# EAGLE design LEDs1 (EAGLE 6.3)
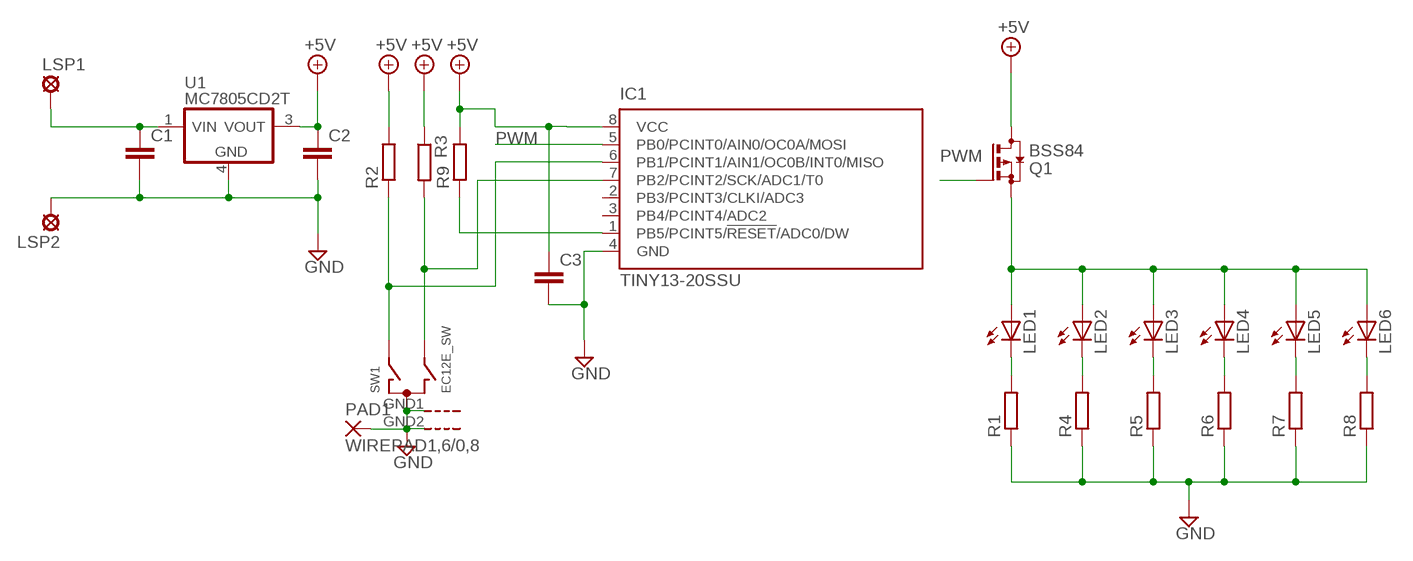
[diagram p0: schematic, sheet 1]

## Parts
C1  C-EUC1206K  [C1206K]
C2  C-EUC1206K  [C1206K]
C3  C-EUC1206K  [C1206K]
IC1  TINY13-20SSU  [8S1]
LED1  LED-2AC-CP41B-WES  [CP41B]
LED2  LED-2AC-CP41B-WES  [CP41B]
LED3  LED-2AC-CP41B-WES  [CP41B]
LED4  LED-2AC-CP41B-WES  [CP41B]
LED5  LED-2AC-CP41B-WES  [CP41B]
LED6  LED-2AC-CP41B-WES  [CP41B]
LSP1  LSP10  [LSP10]
LSP2  LSP10  [LSP10]
PAD1  WIREPAD1,6/0,8  [1,6/0,8]
Q1  BSS84  [SOT23]
R1  R-EU_M0805  [M0805]
R2  R-EU_M1206  [M1206]
R3  R-EU_M1206  [M1206]
R4  R-EU_M0805  [M0805]
R5  R-EU_M0805  [M0805]
R6  R-EU_M0805  [M0805]
R7  R-EU_M0805  [M0805]
R8  R-EU_M0805  [M0805]
R9  R-EU_M0805  [M0805]
SW1  EC12E_SW  [ALPS_EC12E_SW]
U1  MC7805CD2T  [D2PAK-3]

## Nets
+5V: C2.1 C3.1 IC1.8(VCC) Q1.3(D) R2.2 R3.1 R9.2 U1.3(VOUT)
GND: C1.2 C2.2 C3.2 IC1.4(GND) LSP2.MP PAD1.1(P) R1.1 R4.1 R5.1 R6.1 R7.1 R8.1 SW1.C SW1.GND1(G) SW1.GND2(G) U1.4(GND)
N$1: C1.1 LSP1.MP U1.1(VIN)
N$3: IC1.6(PB1/PCINT1/AIN1/OC0B/INT0/MISO) R2.1 SW1.A
N$4: IC1.7(PB2/PCINT2/SCK/ADC1/T0) R3.2 SW1.B
N$5: IC1.1(PB5/PCINT5/!RESET!/ADC0/DW) R9.1
N$7: LED1.2(A) LED1.3(A) LED2.2(A) LED2.3(A) LED3.2(A) LED3.3(A) LED4.2(A) LED4.3(A) LED5.2(A) LED5.3(A) LED6.2(A) LED6.3(A) Q1.2(S)
N$8: LED1.1(C) LED1.4(C) R1.2
N$9: LED2.1(C) LED2.4(C) R4.2
N$10: LED3.1(C) LED3.4(C) R5.2
N$11: LED4.1(C) LED4.4(C) R6.2
N$12: LED5.1(C) LED5.4(C) R7.2
N$13: LED6.1(C) LED6.4(C) R8.2
PWM: IC1.5(PB0/PCINT0/AIN0/OC0A/MOSI) Q1.1(G)
Unconnected: IC1.2(PB3/PCINT3/CLKI/ADC3) IC1.3(PB4/PCINT4/ADC2) SW1.D SW1.E

## Library data of the parts
C1-C3 = rcl:C-EU: CAPACITOR, European symbol
IC1 = atmel:TINY13: 8-bit AVR Microcontroller with 1K Bytes In-System Programmable Flash Source: http://www.atmel.com/dyn/resources/prod_documents/2535S.pdf; MPN: ATTINY13-20SSU; OC_FARNELL: 1455133; OC_NEWARK: 58M3771
LED1-LED6 = led:LED-2AC-: LEDs with 2 Cathode & 2 Anode - Kingbright SUPER FLUX LED LAMP Source: www.us.kingbright.com/images/catalog/SPEC/W7676CPBC-H.pdf Cree® P4 LED CP41B-WES/WGS Source: Data sheet <http://www.cree.com/products/pdf/LEDlamps/CP41B-WES&WGS.pdf>
LSP1 LSP2 = solpad:LSP10: SOLDER PAD drill 1.0 mm, distributor Buerklin, 12H555
PAD1 = wirepad:WIREPAD: Wire PAD connect wire on PCB
Q1 = transistor-small-signal:BSS84: P-CHANNEL MOS FET
R1-R9 = resistor:R-EU_: RESISTOR, European symbol
SW1 = switch-alps:EC12E_SW: ALPS rotary Encoder EC12E series with switch; MPN: EC12E2424407; OC_FARNELL: 1520813; OC_NEWARK: 74M1068
U1 = _hhn_78xx_79xx_NCV78xx_d2pak_dpak:MC78*: 78xx SMD (D2PAK, DPAK) (MC)78xx..DT (DPAK-3; Rth,JA = 92 K/W) (MC)78xx..D2T (D2PAK-3; Rth,JA = 45 K/W @ 10x10mm copper area) Linear Voltage Regulators, Positive, 1 A (ON Semiconductor) Package dimenisions and soldering footprints acc. to ONSEMI specs. Source: http://onsemi.com Datasheet document#: MC7800/D Technologies: 78xxyD(2)Tz: xx = Output Voltage (V) y, z: additional suffixes see manufacturer's datasheet Author: Dipl.-Ing. FH Rainer Bayer HHN Hochschule Heilbronn, rainer.bayer@hs-heilbronn.de Ingenieurbüro ing-rb, mail@ing-rb.de

## Board
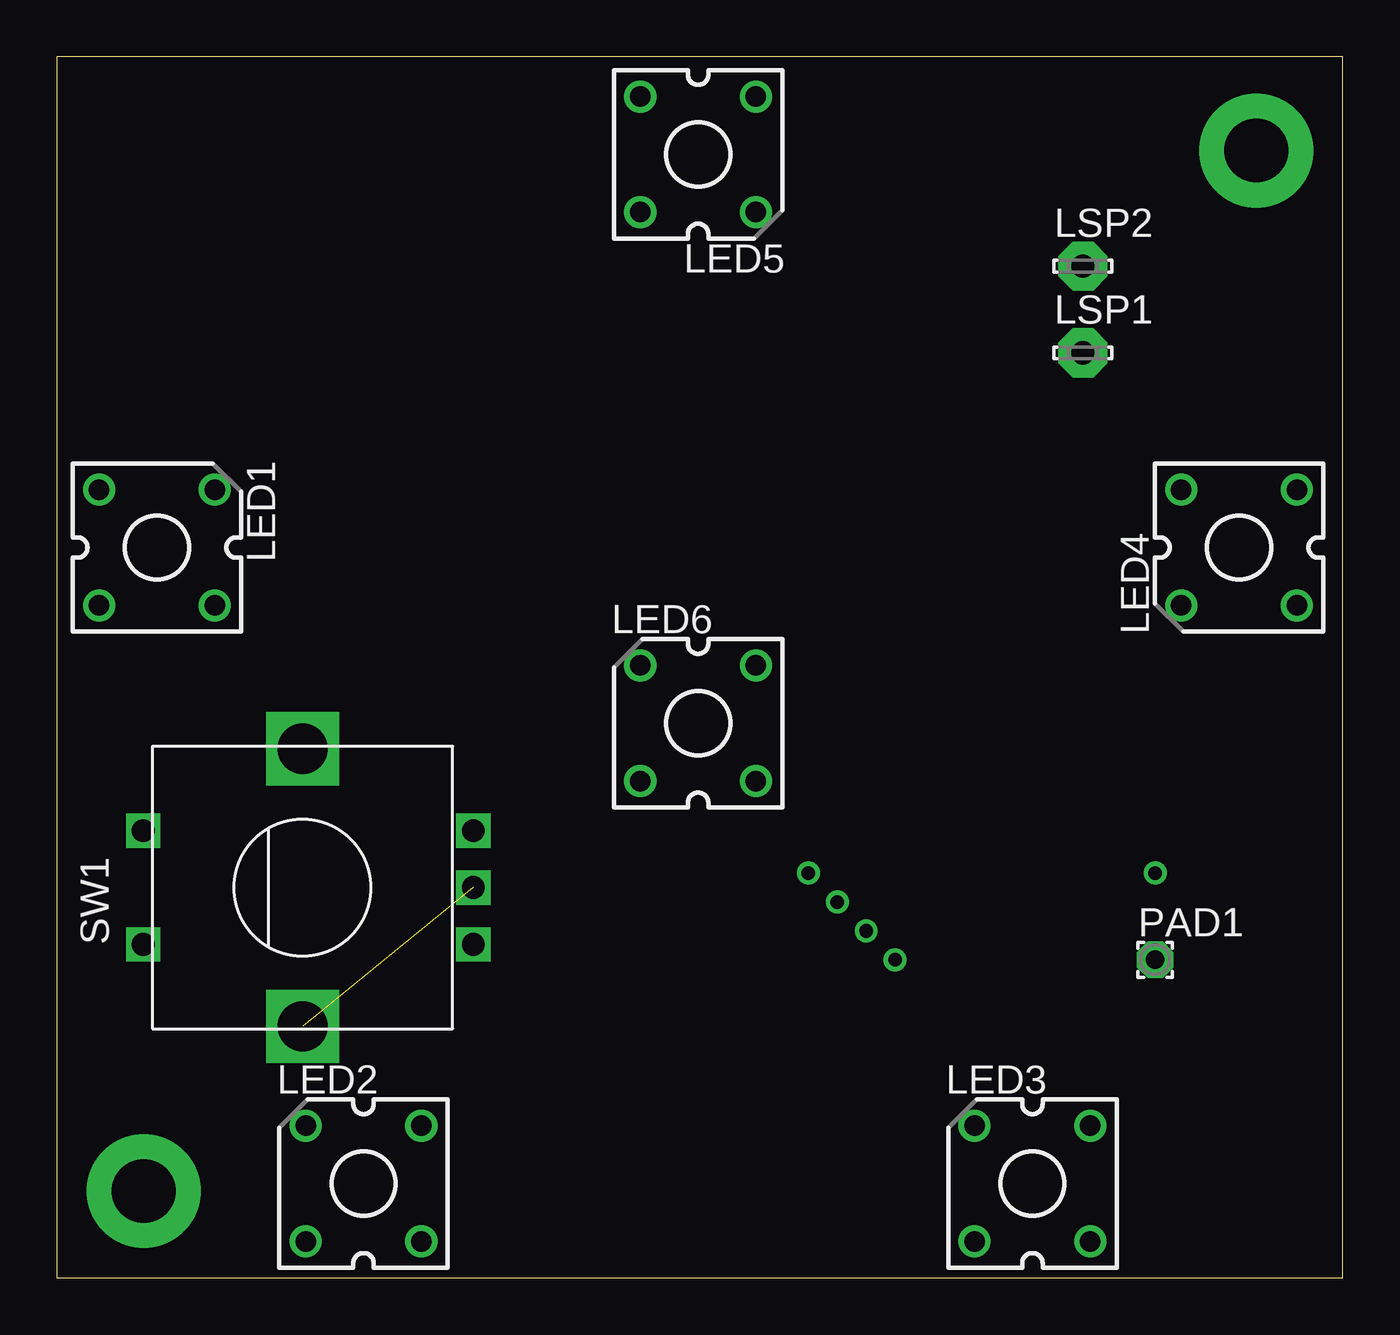
[diagram p1: board, top side]
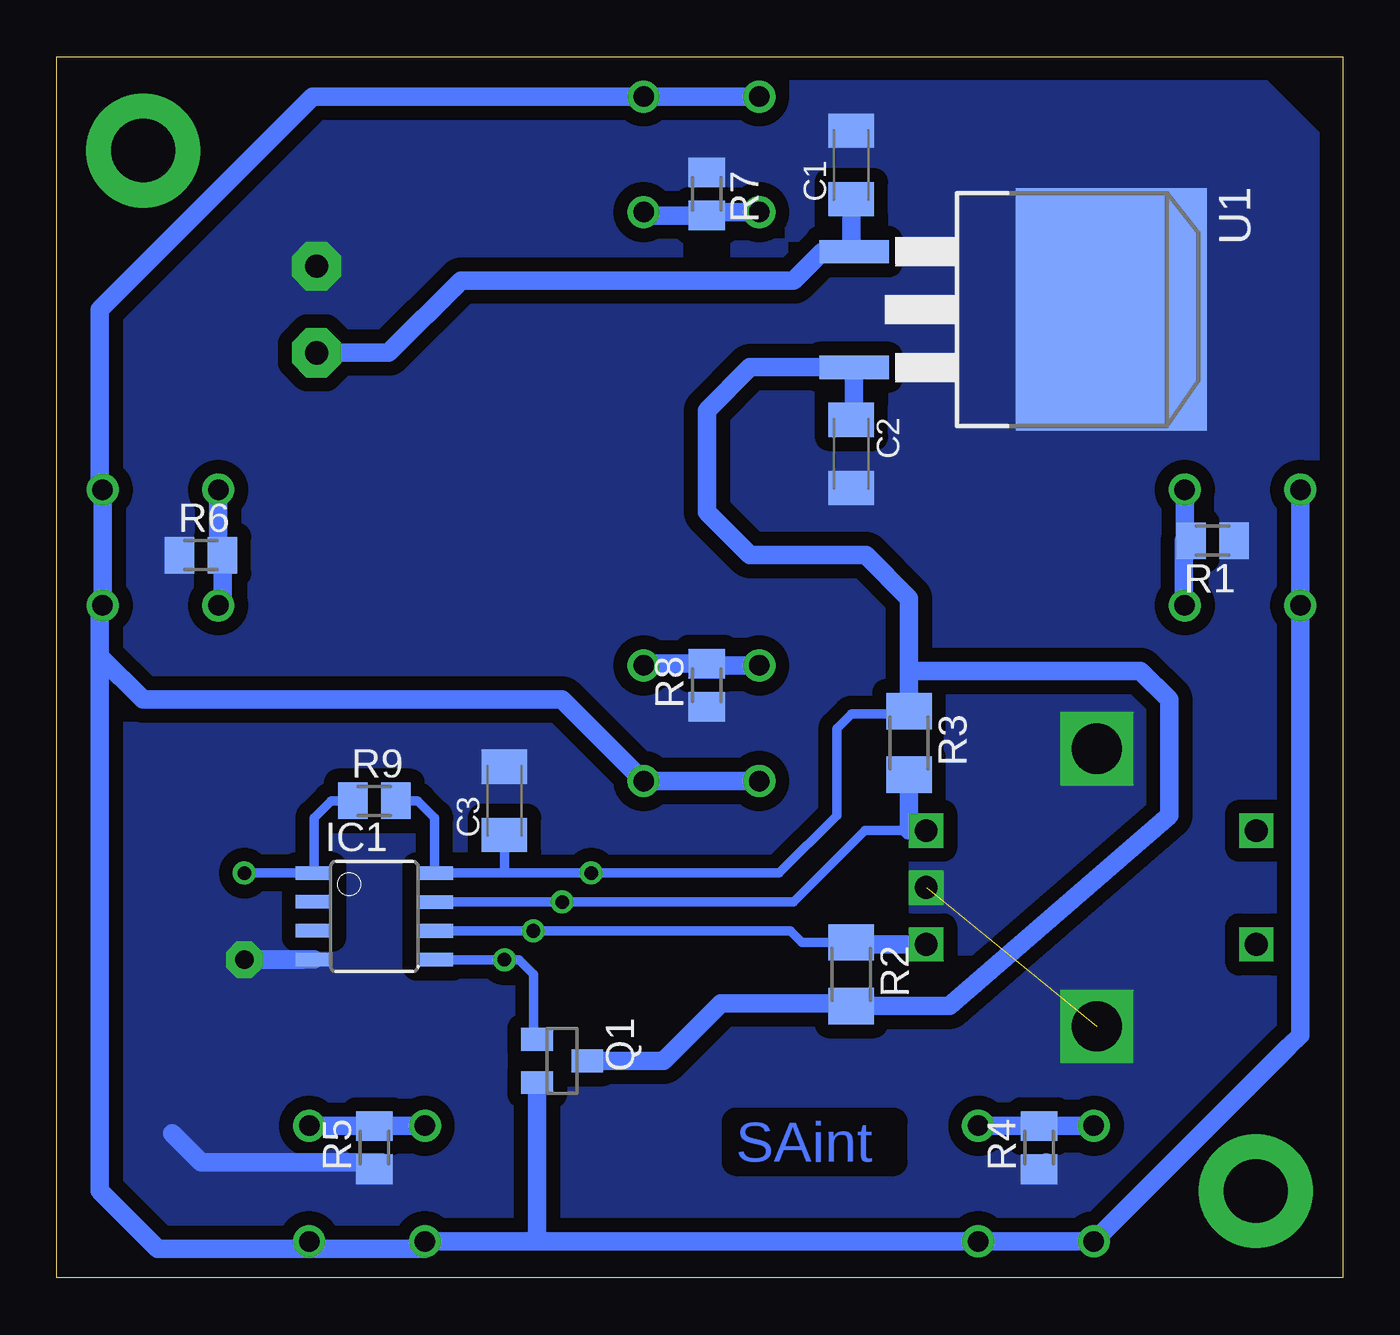
[diagram p2: board, bottom side, seen from below]

Size 56.49 x 53.65 mm. Coordinates in mm from the lower left corner, seen from the top.
Outline: 0,0 56.49,0 56.49,53.65 0,53.65 0,0
Copper layers (1*16): Top 0.035mm / dielectric 1.5mm / Bottom 0.035mm
Design rules "default": minimum track width 10mil, minimum drill 24mil, track to track 8mil, track to pad 8mil, pad to pad 8mil, via to via 8mil, smd to smd 8mil, copper to edge 40mil, drill to drill 8mil, minimum pad ring 10mil, minimum via ring 8mil, stop-mask expansion 4mil, vias tented up to drill 0mil, thermal gap 10mil
bRestrict: area 19.7,15.9 to 22.9,19; 1 lines

### Footprints (pad centres in the part's own frame; a part is rotated, then mirrored left to right if it is on the bottom)
C1206K = smd 1.5 x 2: 1 -1.5,0; 2 1.5,0
8S1 = smd 0.6 x 1.6: 1 -1.905,-2.654; 2 -0.645,-2.654; 3 0.625,-2.654; 4 1.895,-2.654; 5 1.905,2.654; 6 0.635,2.654; 7 -0.635,2.654; 8 -1.905,2.654
CP41B = drill 0.9 pad 1.27: 1 -2.54,2.54; 2 -2.54,-2.54; 3 2.54,-2.54; 4 2.54,2.54
LSP10 = drill 1.016 pad 2.159 octagon: MP 0,0
1,6/0,8 = drill 0.813 pad 1.6 octagon: 1 0,0
SOT23 = smd 1 x 1.4: 1 -0.95,-1.1; 2 0.95,-1.1; 3 0,1.1
M0805 = smd 1.3 x 1.6: 1 -0.95,0; 2 0.95,0
M1206 = smd 1.6 x 2: 1 -1.4,0; 2 1.4,0
ALPS_EC12E_SW = drill 1 square: A -2.5,-7.5; B 2.5,-7.5; C 0,-7.5; D -2.5,7; E 2.5,7 | drill 2.2 square: GND1 -6.1,0; GND2 6.1,0
D2PAK-3 = smd 1.016 x 3.05: 1 -2.54,-11.31; 3 2.54,-11.31 | smd 10.66 x 8.38: 4 0,0

### Placement (x,y rotation side)
C1  21.59,48.9 90 bottom
C2  21.59,36.2 270 bottom
C3  36.83,20.95 90 bottom
IC1  42.54,15.88 270 bottom
LED1  4.39,32.09 270 top
LED2  13.48,4.13 0 top
LED3  42.86,4.13 0 top
LED4  51.95,32.09 90 top
LED5  28.18,49.37 180 top
LED6  28.18,24.36 0 top
LSP1  45.08,40.64 0 top
LSP2  45.08,44.45 0 top
PAD1  48.26,13.97 0 top
Q1  34.29,9.53 270 bottom
R1  5.71,32.39 180 bottom
R2  21.59,13.34 270 bottom
R3  19.05,23.49 270 bottom
R4  13.34,5.71 90 bottom
R5  42.54,5.71 90 bottom
R6  50.16,31.75 0 bottom
R7  27.94,47.62 270 bottom
R8  27.94,26.04 90 bottom
R9  42.54,20.95 0 bottom
SW1  10.79,17.14 90 top
U1  10.16,42.55 270 bottom

### Tracks (layer width: path | path; a pad name or v marks a point on that pad's centre or on a via)
+5V  (via drill 0.6)
  Bottom 0.406: R9.2 40.64,20.95 39.89,20.21 IC1.8 36.83,17.78 | 36.83,17.78 v33.02,17.78 24.77,17.78 22.23,20.32 22.23,24.13 21.59,24.76 19.18,24.76 | 36.83,17.78 C3.1
  Bottom 0.813: 19.05,26.67 8.89,26.67 7.62,25.4 7.62,20.32 17.27,11.94 R2.2 21.72,12.06 27.3,12.06 29.85,9.53 Q1.3 | 19.05,26.67 R3.1 19.18,24.76 | C2.1 21.47,37.82 U1.3 26.04,40.01 27.94,38.1 27.94,33.66 26.04,31.75 20.96,31.75 19.05,29.84 19.05,26.67
GND  (1 unrouted)
  Bottom 0.813: 13.02,5.08 R4.1 | R5.1 42.23,5.08 50.16,5.08 51.43,6.35 | 45.72,13.97 PAD1.1 48.25,13.98 IC1.4
  pour Bottom (isolate 0.61, no thermals): 0,53.34 56.52,53.34 56.52,0 0,0 0,52.71
N$1
  Bottom 0.813: U1.1 21.59,45.09 | 21.59,45.09 C1.1 | 21.59,45.09 22.86,45.09 24.13,43.82 38.73,43.82 41.91,40.64 LSP1.MP
N$3  (via drill 0.6)
  Bottom 0.406: IC1.6 v35.56,15.24 24.26,15.24 23.75,14.73 R2.1
  Bottom 0.813: SW1.A 21.5,14.64 R2.1
N$4  (via drill 0.6)
  Bottom 0.406: IC1.7 v34.29,16.51 24.13,16.51 21,19.64 19.05,19.64 SW1.B
  Bottom 0.813: R3.2 19.05,19.64
N$5
  Bottom 0.406: IC1.1 45.2,20.21 44.45,20.95 R9.1
N$7
  Bottom 0.813: LED5.3 LED5.2 45.25,51.91 54.61,42.55 54.61,34.75 LED4.3 LED4.2 54.61,29.54 54.61,27.3 | 54.61,27.3 54.61,3.81 52.07,1.27 45.4,1.27 | 45.4,1.27 LED3.3 | 45.4,1.27 40.32,1.27 LED3.2 35.56,1.59 | 35.56,1.59 LED2.3 LED2.2 2.35,10.16 1.85,10.66 LED1.3 LED1.2 | Q1.2 35.39,1.76 35.56,1.59 | LED6.2 LED6.3 34.29,25.4 52.7,25.4 54.61,27.3
N$8
  Bottom 0.813: LED1.1 6.93,32.44 | 6.93,32.44 6.98,32.39 6.98,29.59 LED1.4 | R1.2 6.88,32.39 6.93,32.44
N$9
  Bottom 0.813: LED2.1 R4.2 LED2.4
N$10
  Bottom 0.813: LED3.1 R5.2 LED3.4
N$11
  Bottom 0.813: LED4.4 49.4,31.94 R6.2 49.21,29.73 LED4.1
N$12
  Bottom 0.813: LED5.4 27.79,46.83 R7.2 30.57,46.68 LED5.1
N$13
  Bottom 0.813: LED6.1 27.94,26.9 R8.2 30.71,26.98 LED6.4
N$14  (via drill 0.6)
  Bottom 0.406: 45.72,17.78 v48.26,17.78
N$15  (via drill 0.6)
  other vias: 36.83,13.97
N$16  (via drill 2.8 pad 5)
  other vias: 3.81,3.81
N$17  (via drill 2.8 pad 5)
  other vias: 52.7,49.53
PWM
  Bottom 0.406: IC1.5 36.2,13.97 35.56,13.34 35.56,10.64 Q1.1

### Text on the board
Bottom: SAint